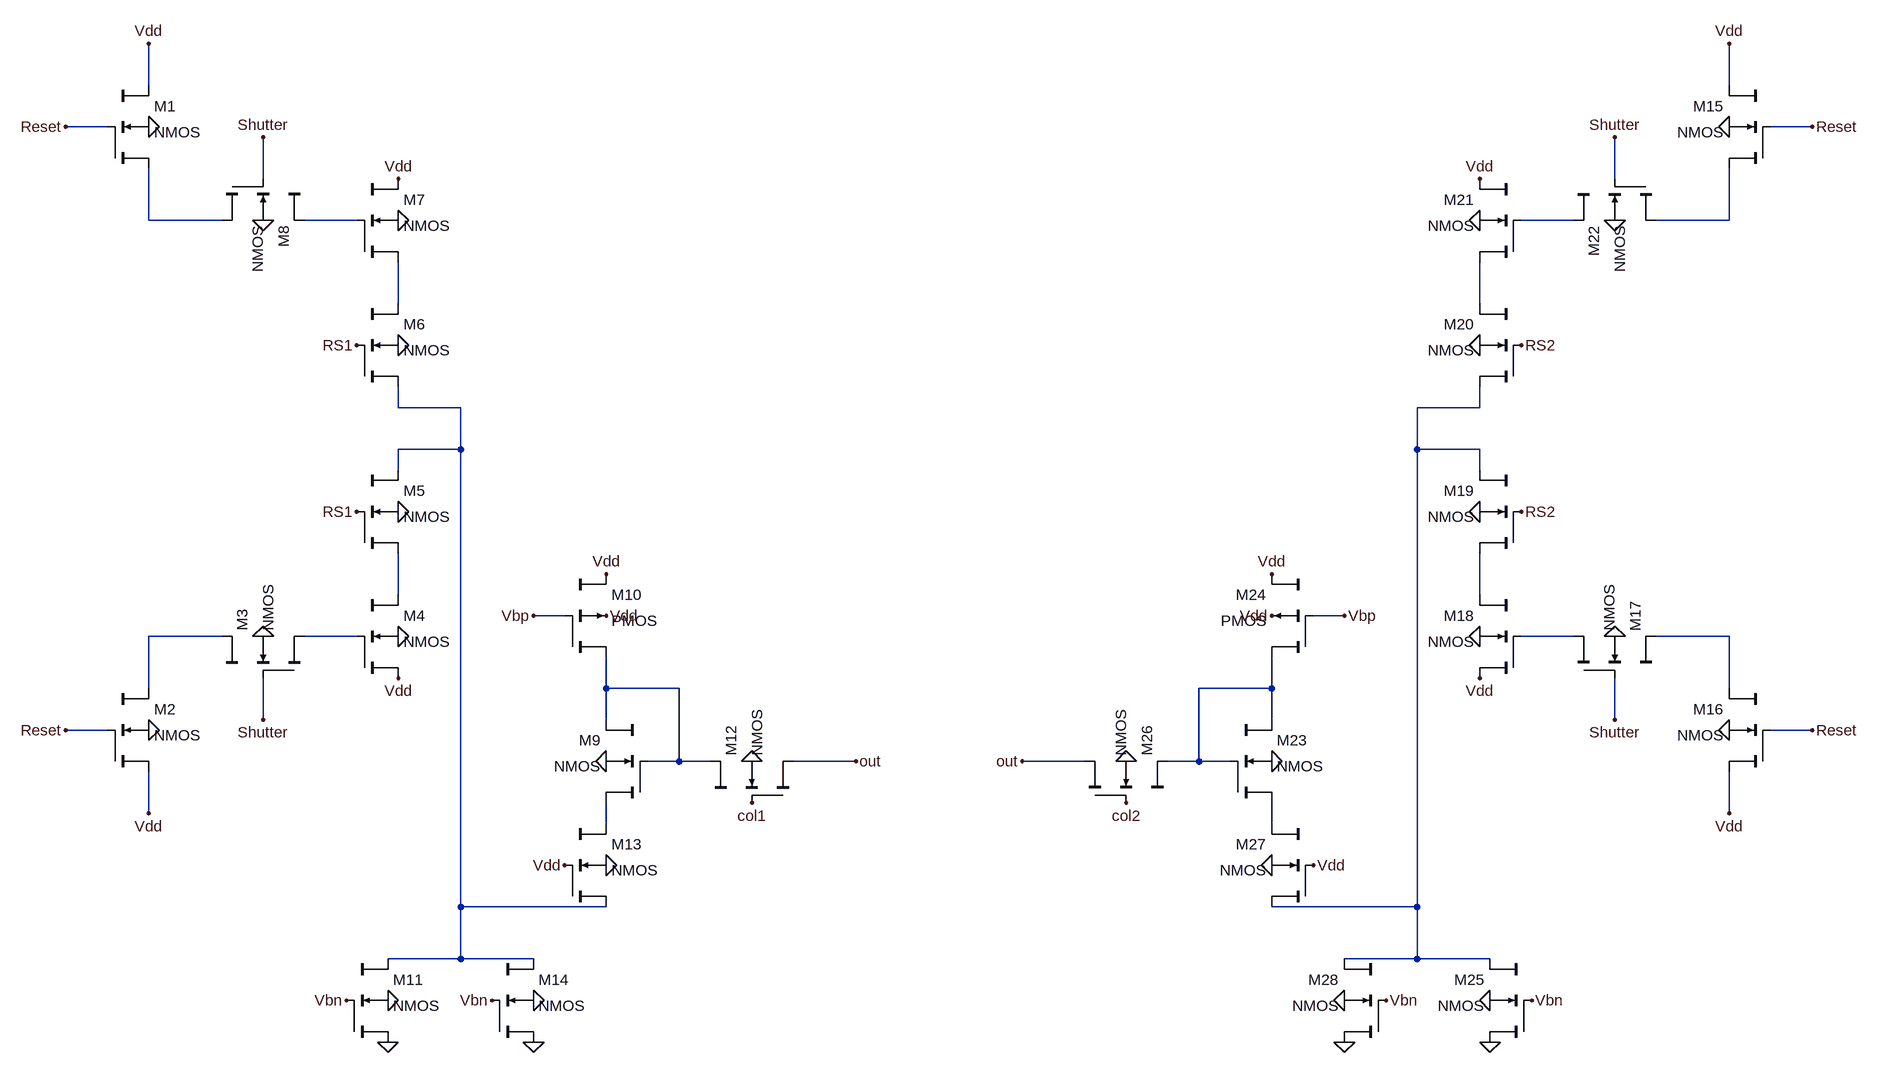
[diagram p0: schematic pixel_lvs.asc]
pixel_lvs.asc, the LTspice schematic file:
Version 4
SHEET 1 2860 1556
WIRE 208 -160 208 -224
WIRE 2640 -160 2640 -224
WIRE 144 -96 80 -96
WIRE 2768 -96 2704 -96
WIRE 384 -16 384 -80
WIRE 2464 -16 2464 -80
WIRE 208 48 208 -32
WIRE 320 48 208 48
WIRE 528 48 448 48
WIRE 2400 48 2320 48
WIRE 2640 48 2640 -32
WIRE 2640 48 2528 48
WIRE 592 176 592 112
WIRE 2256 176 2256 112
WIRE 592 336 592 304
WIRE 688 336 592 336
WIRE 2256 336 2256 304
WIRE 2256 336 2160 336
WIRE 688 400 688 336
WIRE 688 400 592 400
WIRE 2160 400 2160 336
WIRE 2256 400 2160 400
WIRE 592 432 592 400
WIRE 2256 432 2256 400
WIRE 592 624 592 560
WIRE 2256 624 2256 560
WIRE 848 656 800 656
WIRE 2048 656 2000 656
WIRE 320 688 208 688
WIRE 528 688 448 688
WIRE 2400 688 2320 688
WIRE 2640 688 2528 688
WIRE 208 768 208 688
WIRE 912 768 912 720
WIRE 1024 768 912 768
WIRE 1936 768 1936 720
WIRE 1936 768 1824 768
WIRE 2640 768 2640 688
WIRE 384 816 384 752
WIRE 912 816 912 768
WIRE 1936 816 1936 768
WIRE 2464 816 2464 752
WIRE 144 832 80 832
WIRE 2768 832 2704 832
WIRE 1024 880 1024 768
WIRE 1024 880 976 880
WIRE 1072 880 1024 880
WIRE 1296 880 1200 880
WIRE 1648 880 1552 880
WIRE 1824 880 1824 768
WIRE 1824 880 1776 880
WIRE 1872 880 1824 880
WIRE 208 960 208 896
WIRE 2640 960 2640 896
WIRE 912 976 912 944
WIRE 1936 976 1936 944
WIRE 688 1104 688 400
WIRE 912 1104 688 1104
WIRE 2160 1104 2160 400
WIRE 2160 1104 1936 1104
WIRE 688 1184 688 1104
WIRE 688 1184 576 1184
WIRE 800 1184 688 1184
WIRE 2160 1184 2160 1104
WIRE 2160 1184 2048 1184
WIRE 2272 1184 2160 1184
FLAG 208 -224 Vdd
FLAG 592 -16 Vdd
FLAG 528 240 RS1
FLAG 80 -96 Reset
FLAG 384 -80 Shutter
FLAG 208 960 Vdd
FLAG 592 752 Vdd
FLAG 528 496 RS1
FLAG 80 832 Reset
FLAG 384 816 Shutter
FLAG 208 -96 0
FLAG 208 832 0
FLAG 384 688 0
FLAG 592 688 0
FLAG 592 496 0
FLAG 592 240 0
FLAG 592 48 0
FLAG 384 48 0
FLAG 912 880 0
FLAG 912 656 Vdd
FLAG 576 1248 0
FLAG 912 592 Vdd
FLAG 800 656 Vbp
FLAG 1136 880 0
FLAG 1136 944 col1
FLAG 912 1040 0
FLAG 848 1040 Vdd
FLAG 800 1248 0
FLAG 736 1248 Vbn
FLAG 512 1248 Vbn
FLAG 576 1312 0
FLAG 800 1312 0
FLAG 2640 -224 Vdd
FLAG 2256 -16 Vdd
FLAG 2320 240 RS2
FLAG 2768 -96 Reset
FLAG 2464 -80 Shutter
FLAG 2640 960 Vdd
FLAG 2256 752 Vdd
FLAG 2320 496 RS2
FLAG 2768 832 Reset
FLAG 2464 816 Shutter
FLAG 2640 -96 0
FLAG 2640 832 0
FLAG 2464 688 0
FLAG 2256 688 0
FLAG 2256 496 0
FLAG 2256 240 0
FLAG 2256 48 0
FLAG 2464 48 0
FLAG 1936 880 0
FLAG 1936 656 Vdd
FLAG 2272 1248 0
FLAG 1936 592 Vdd
FLAG 2048 656 Vbp
FLAG 1712 880 0
FLAG 1712 944 col2
FLAG 1936 1040 0
FLAG 2000 1040 Vdd
FLAG 2048 1248 0
FLAG 2112 1248 Vbn
FLAG 2336 1248 Vbn
FLAG 2272 1312 0
FLAG 2048 1312 0
FLAG 1552 880 out
FLAG 1296 880 out
SYMBOL cktsym\\nmos4 208 -96 R0
SYMATTR InstName M1
SYMATTR SpiceModel ""
SYMATTR Value2 l=0.6u w=0.9u
SYMATTR SpiceLine ""
SYMATTR SpiceLine2 ""
SYMBOL cktsym\\nmos4 208 832 R0
SYMATTR InstName M2
SYMATTR SpiceModel ""
SYMATTR Value2 l=0.6u w=0.9u
SYMATTR SpiceLine ""
SYMATTR SpiceLine2 ""
SYMBOL cktsym\\nmos4 384 688 R270
SYMATTR InstName M3
SYMATTR SpiceModel ""
SYMATTR Value2 l=0.6u w=0.9u
SYMATTR SpiceLine ""
SYMATTR SpiceLine2 ""
SYMBOL cktsym\\nmos4 592 688 R0
SYMATTR InstName M4
SYMATTR SpiceModel ""
SYMATTR Value2 l=0.6u w=0.9u
SYMATTR SpiceLine ""
SYMATTR SpiceLine2 ""
SYMBOL cktsym\\nmos4 592 496 R0
SYMATTR InstName M5
SYMATTR SpiceModel ""
SYMATTR Value2 l=0.6u w=0.9u
SYMATTR SpiceLine ""
SYMATTR SpiceLine2 ""
SYMBOL cktsym\\nmos4 592 240 R0
SYMATTR InstName M6
SYMATTR SpiceModel ""
SYMATTR Value2 l=0.6u w=0.9u
SYMATTR SpiceLine ""
SYMATTR SpiceLine2 ""
SYMBOL cktsym\\nmos4 592 48 R0
SYMATTR InstName M7
SYMATTR SpiceModel ""
SYMATTR Value2 l=0.6u w=0.9u
SYMATTR SpiceLine ""
SYMATTR SpiceLine2 ""
SYMBOL cktsym\\nmos4 384 48 R90
SYMATTR InstName M8
SYMATTR SpiceModel ""
SYMATTR Value2 l=0.6u w=0.9u
SYMATTR SpiceLine ""
SYMATTR SpiceLine2 ""
SYMBOL cktsym\\nmos4 912 880 M0
SYMATTR InstName M9
SYMATTR SpiceModel ""
SYMATTR Value2 l=0.6u w=0.9u
SYMATTR SpiceLine ""
SYMATTR SpiceLine2 ""
SYMBOL cktsym\\pmos4 912 656 R0
SYMATTR InstName M10
SYMBOL cktsym\\nmos4 576 1248 R0
SYMATTR InstName M11
SYMATTR SpiceModel ""
SYMATTR Value2 l=0.6u w=0.9u
SYMATTR SpiceLine ""
SYMATTR SpiceLine2 ""
SYMBOL cktsym\\nmos4 1136 880 R270
SYMATTR InstName M12
SYMATTR SpiceModel ""
SYMATTR Value2 l=0.6u w=0.9u
SYMATTR SpiceLine ""
SYMATTR SpiceLine2 ""
SYMBOL cktsym\\nmos4 912 1040 R0
SYMATTR InstName M13
SYMATTR SpiceModel ""
SYMATTR Value2 l=0.6u w=0.9u
SYMATTR SpiceLine ""
SYMATTR SpiceLine2 ""
SYMBOL cktsym\\nmos4 800 1248 R0
SYMATTR InstName M14
SYMATTR SpiceModel ""
SYMATTR Value2 l=0.6u w=0.9u
SYMATTR SpiceLine ""
SYMATTR SpiceLine2 ""
SYMBOL cktsym\\nmos4 2640 -96 M0
SYMATTR InstName M15
SYMATTR SpiceModel ""
SYMATTR Value2 l=0.6u w=0.9u
SYMATTR SpiceLine ""
SYMATTR SpiceLine2 ""
SYMBOL cktsym\\nmos4 2640 832 M0
SYMATTR InstName M16
SYMATTR SpiceModel ""
SYMATTR Value2 l=0.6u w=0.9u
SYMATTR SpiceLine ""
SYMATTR SpiceLine2 ""
SYMBOL cktsym\\nmos4 2464 688 M270
SYMATTR InstName M17
SYMATTR SpiceModel ""
SYMATTR Value2 l=0.6u w=0.9u
SYMATTR SpiceLine ""
SYMATTR SpiceLine2 ""
SYMBOL cktsym\\nmos4 2256 688 M0
SYMATTR InstName M18
SYMATTR SpiceModel ""
SYMATTR Value2 l=0.6u w=0.9u
SYMATTR SpiceLine ""
SYMATTR SpiceLine2 ""
SYMBOL cktsym\\nmos4 2256 496 M0
SYMATTR InstName M19
SYMATTR SpiceModel ""
SYMATTR Value2 l=0.6u w=0.9u
SYMATTR SpiceLine ""
SYMATTR SpiceLine2 ""
SYMBOL cktsym\\nmos4 2256 240 M0
SYMATTR InstName M20
SYMATTR SpiceModel ""
SYMATTR Value2 l=0.6u w=0.9u
SYMATTR SpiceLine ""
SYMATTR SpiceLine2 ""
SYMBOL cktsym\\nmos4 2256 48 M0
SYMATTR InstName M21
SYMATTR SpiceModel ""
SYMATTR Value2 l=0.6u w=0.9u
SYMATTR SpiceLine ""
SYMATTR SpiceLine2 ""
SYMBOL cktsym\\nmos4 2464 48 M90
SYMATTR InstName M22
SYMATTR SpiceModel ""
SYMATTR Value2 l=0.6u w=0.9u
SYMATTR SpiceLine ""
SYMATTR SpiceLine2 ""
SYMBOL cktsym\\nmos4 1936 880 R0
SYMATTR InstName M23
SYMATTR SpiceModel ""
SYMATTR Value2 l=0.6u w=0.9u
SYMATTR SpiceLine ""
SYMATTR SpiceLine2 ""
SYMBOL cktsym\\pmos4 1936 656 M0
SYMATTR InstName M24
SYMBOL cktsym\\nmos4 2272 1248 M0
SYMATTR InstName M25
SYMATTR SpiceModel ""
SYMATTR Value2 l=0.6u w=0.9u
SYMATTR SpiceLine ""
SYMATTR SpiceLine2 ""
SYMBOL cktsym\\nmos4 1712 880 M270
SYMATTR InstName M26
SYMATTR SpiceModel ""
SYMATTR Value2 l=0.6u w=0.9u
SYMATTR SpiceLine ""
SYMATTR SpiceLine2 ""
SYMBOL cktsym\\nmos4 1936 1040 M0
SYMATTR InstName M27
SYMATTR SpiceModel ""
SYMATTR Value2 l=0.6u w=0.9u
SYMATTR SpiceLine ""
SYMATTR SpiceLine2 ""
SYMBOL cktsym\\nmos4 2048 1248 M0
SYMATTR InstName M28
SYMATTR SpiceModel ""
SYMATTR Value2 l=0.6u w=0.9u
SYMATTR SpiceLine ""
SYMATTR SpiceLine2 ""

The netlist it stands for:
* pixel_lvs.asc
M1 Vdd Reset N001 0 NMOS l=0.6u w=0.9u
M2 N011 Reset Vdd 0 NMOS l=0.6u w=0.9u
M3 N011 Shutter N012 0 NMOS l=0.6u w=0.9u
M4 N009 N012 Vdd 0 NMOS l=0.6u w=0.9u
M5 N007 RS1 N009 0 NMOS l=0.6u w=0.9u
M6 N005 RS1 N007 0 NMOS l=0.6u w=0.9u
M7 Vdd N002 N005 0 NMOS l=0.6u w=0.9u
M8 N002 Shutter N001 0 NMOS l=0.6u w=0.9u
M9 N015 N015 N017 0 NMOS l=0.6u w=0.9u
M10 N015 Vbp Vdd Vdd PMOS
M11 N007 Vbn 0 0 NMOS l=0.6u w=0.9u
M12 N015 col1 out 0 NMOS l=0.6u w=0.9u
M13 N017 Vdd N007 0 NMOS l=0.6u w=0.9u
M14 N007 Vbn 0 0 NMOS l=0.6u w=0.9u
M15 Vdd Reset N004 0 NMOS l=0.6u w=0.9u
M16 N014 Reset Vdd 0 NMOS l=0.6u w=0.9u
M17 N014 Shutter N013 0 NMOS l=0.6u w=0.9u
M18 N010 N013 Vdd 0 NMOS l=0.6u w=0.9u
M19 N008 RS2 N010 0 NMOS l=0.6u w=0.9u
M20 N006 RS2 N008 0 NMOS l=0.6u w=0.9u
M21 Vdd N003 N006 0 NMOS l=0.6u w=0.9u
M22 N003 Shutter N004 0 NMOS l=0.6u w=0.9u
M23 N016 N016 N018 0 NMOS l=0.6u w=0.9u
M24 N016 Vbp Vdd Vdd PMOS
M25 N008 Vbn 0 0 NMOS l=0.6u w=0.9u
M26 N016 col2 out 0 NMOS l=0.6u w=0.9u
M27 N018 Vdd N008 0 NMOS l=0.6u w=0.9u
M28 N008 Vbn 0 0 NMOS l=0.6u w=0.9u
.model NMOS NMOS
.model PMOS PMOS
.lib standard.mos
.backanno
.end